# Altium schematic sheet power_block.SchDoc
size A4
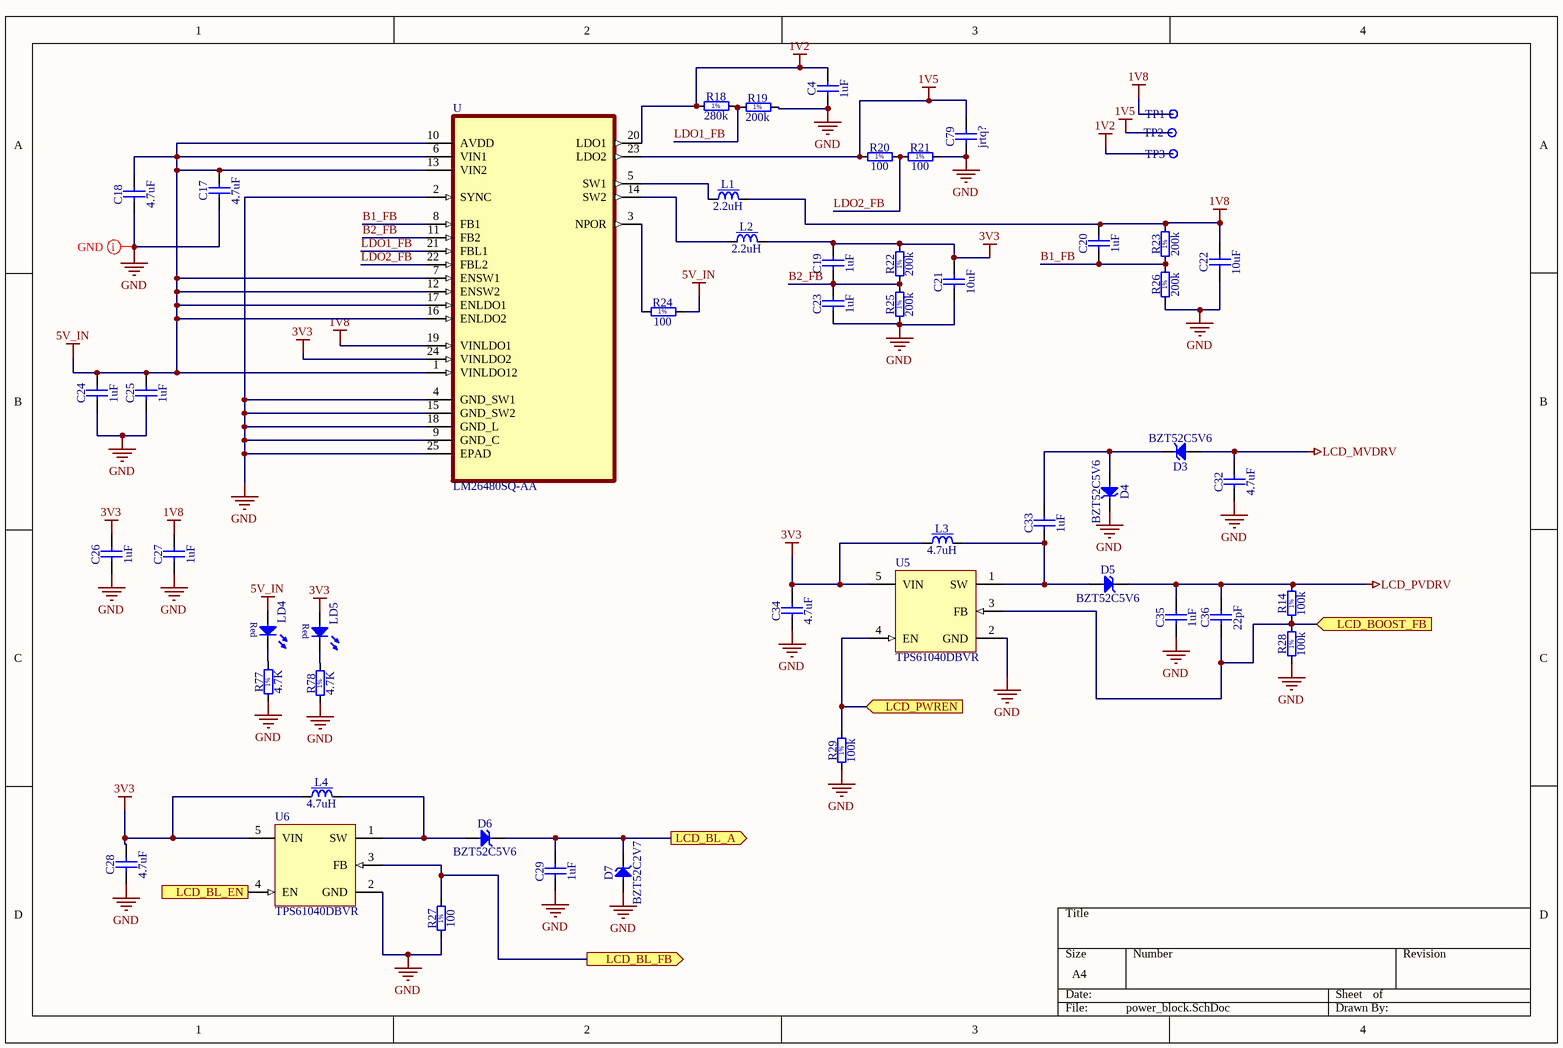
[diagram p0: power_block.SchDoc]

## Parts
C4  1uF  [CAPC2013X100N]
C17  4.7uF  [CAPC2013X100N]
C18  4.7uF  [CAPC2013X100N]
C19  1uF  [CAPC2013X100N]
C20  1uF  [CAPC2013X100N]
C21  10uF  [CAPC2013X100N]
C22  10uF  [CAPC2013X100N]
C23  1uF  [CAPC2013X100N]
C24  1uF  [CAPC2013X100N]
C25  1uF  [CAPC2013X100N]
C26  1uF  [CAPC2013X100N]
C27  1uF  [CAPC2013X100N]
C28  4.7uF  [CAPC2013X100N]
C29  1uF  [CAPC2013X100N]
C32  4.7uF  [CAPC2013X100N]
C33  1uF  [CAPC2013X100N]
C34  4.7uF  [CAPC2013X100N]
C35  1uF  [CAPC2013X100N]
C36  22pF  [CAPC2013X100N]
C79  jrtq?  [CAPC2013X100N]
D3  BZT52C5V6  [SOD3715X145N]
D4  BZT52C5V6  [SOD3715X145N]
D5  BZT52C5V6  [SOD3715X145N]
D6  BZT52C5V6  [SOD3715X145N]
D7  BZT52C2V7  [SOD3715X145N]
L1  2.2uH  [IND_MURATA-PS_8200]
L2  2.2uH  [IND_MURATA-PS_8200]
L3  4.7uH  [IND_MURATA-PS_8200]
L4  4.7uH  [IND_MURATA-PS_8200]
LD4  Super Red  [LED_OSRAM_LSR976]  (value not drawn)
LD5  Super Red  [LED_OSRAM_LSR976]  (value not drawn)
R14  100k  [RESC1608X55N]
R18  280k  [RESC1608X55N]
R19  200k  [RESC1608X55N]
R20  100  [RESC1608X55N]
R21  100  [RESC1608X55N]
R22  200k  [RESC1608X55N]
R23  200k  [RESC1608X55N]
R24  100  [RESC1608X55N]
R25  200k  [RESC1608X55N]
R26  200k  [RESC1608X55N]
R27  100  [RESC1608X55N]
R28  100k  [RESC1608X55N]
R29  100k  [RESC1608X55N]
R77  4.7K  [RESC1608X55N]
R78  4.7K  [RESC1608X55N]
TP1  Test Point  [TPS127]  (value not drawn)
TP2  Test Point  [TPS127]  (value not drawn)
TP3  Test Point  [TPS127]  (value not drawn)
U  LM26480SQ-AA  [QFN400X400X80-25N]
U5  TPS61040DBVR  [TI-DBV5_L]
U6  TPS61040DBVR  [TI-DBV5_L]

## Ports
LCD_BL_A (out), LCD_BL_EN (in), LCD_BL_FB (out), LCD_BOOST_FB (in), LCD_PWREN (in)

## Nets
1V2: C4.2 R18.1 TP3.1 U.20(LDO1)
1V5: C79.2 R20.1 TP2.1 U.23(LDO2)
1V8: C20.2 C22.2 C27.2 L1.2 R23.2 TP1.1 U.19(VINLDO1)
3V3: C19.2 C21.2 C26.2 C28.2 C34.2 L2.2 L3.1 L4.1 LD5.2(A) R22.2 U.24(VINLDO2) U5.5(VIN) U6.5(VIN)
5V_IN: C17.2 C18.2 C24.2 C25.2 LD4.2(A) R24.2 U.1(VINLDO12) U.6(VIN1) U.7(ENSW1) U.10(AVDD) U.12(ENSW2) U.13(VIN2) U.16(ENLDO2) U.17(ENLDO1)
GND: C4.1 C17.1 C18.1 C21.1 C22.1 C23.1 C24.1 C25.1 C26.1 C27.1 C28.1 C29.1 C32.1 C34.1 C35.1 C79.1 D4.1(C) D7.2(A) R19.2 R21.2 R25.1 R26.1 R27.1 R28.1 R29.1 R77.1 R78.1 U.2(SYNC) U.4(GND_SW1) U.9(GND_C) U.15(GND_SW2) U.18(GND_L) U.25(EPAD) U5.2(GND) U6.2(GND)
LCD_MVDRV: C32.2 D3.2(A)
LCD_PVDRV: C35.2 C36.2 D5.1(C) R14.2
B1_FB: C20.1 R23.1 R26.2 U.8(FB1)
B2_FB: C19.1 C23.2 R22.1 R25.2 U.11(FB2)
LCD_BL_A: C29.2 D6.1(C) D7.1(C) ; port LCD_BL_A
LCD_BL_EN: U6.4(EN) ; port LCD_BL_EN
LCD_BL_FB: R27.2 U6.3(FB) ; port LCD_BL_FB
LCD_BOOST_FB: C36.1 R14.1 R28.2 U5.3(FB) ; port LCD_BOOST_FB
LCD_PWREN: R29.2 U5.4(EN) ; port LCD_PWREN
LDO1_FB: R18.2 R19.1 U.21(FBL1)
LDO2_FB: R20.2 R21.1 U.22(FBL2)
NetC33_1: C33.1 D5.2(A) L3.2 U5.1(SW)
NetC33_2: C33.2 D3.1(C) D4.2(A)
NetD6_2: D6.2(A) L4.2 U6.1(SW)
NetL1_1: L1.1 U.5(SW1)
NetL2_1: L2.1 U.14(SW2)
NetLD4_1: LD4.1(C) R77.2
NetLD5_1: LD5.1(C) R78.2
NetR24_1: R24.1 U.3(NPOR)

## Layout directives
rule Clearance Constraint [Clearance = 0.1mm]: GND

## Notes on the sheet
- (in symbol LED_OSRAM_LSR976) Red
- (in symbol R0603_100K_1%_0.1W_100PPM) 1%

## Library data of the parts
C4 C17-C29 C32-C36 C79 = CC0805_1.5NF_50V_5%_C0G: Non-polarised capacitor; Part Description: SMD Multilayer Chip Ceramic Capacitor; Manufacturer: GENERIC; Manufacturer1 Part Number: C0805C152J5GACTU; Value: 1.5nF; Voltage: 50V; TC: C0G/NP0; Tolerance: ±5%; Part Number: CC0805_1.5NF_50V_5%_C0G; Component Kind: Standard; Component Type: Standard; Pin Count: 2; Status: Preferred; Manufacturer Part Number: CC0805_1.5NF_50V_5%_C0G; Case: 0805; Mounted: Yes; Socket: No; SMD: Yes; Sense: No; Manufacturer1 Example: KEMET; Manufacturer1 ComponentHeight: 1mm; HelpURL: \\cern.ch\dfs\Applications\Altium\Datasheets\CC0805_C0G_KEMET_(Commercial Grade).pdf; Author: CERN DEM BC; CreateDate: 18.11.2015; LatestRevisionDate: 18.11.2015
D3-D6 = BZT52C5V6: Zener Diode; Part Description: Surface Mount Zener Diode; Manufacturer: DIODES INCORPORATED; Voltage: 5V6; Power: 0.5W; PressFit: No; Bonding: No; Part Number: BZT52C5V6; Component Kind: Standard; Component Type: Standard; Device: BZT52C5V6; PackageDescription: SOD Diode (SOD123); 2.70mm W X 1.55mm L X 1.45mm H body, IPC Medium Density; Manufacturer Part Number: BZT52C5V6; Pin Count: 2; Case: SOD123; Mounted: Yes; Socket: No; SMD: Yes; Sense: No; ComponentHeight: 1.45mm; HelpURL: \\cern.ch\dfs\Applications\Altium\Datasheets\BZT52C5V6.pdf; Author: CERN DEM JLC; CreateDate: 02.03.2015; LatestRevisionDate: 02.03.2015
D7 = BZT52C2V7: Zener Diode; Part Description: Surface Mount Zener Diode; Manufacturer: DIODES INCORPORATED; Voltage: 2V7; Power: 500mW; PressFit: No; Bonding: No; Part Number: BZT52C2V7; Component Kind: Standard; Component Type: Standard; Device: BZT52C2V7; PackageDescription: SOD Diode (SOD123); 2.70mm W X 1.55mm L X 1.45mm H body, IPC Medium Density; Manufacturer Part Number: BZT52C2V7; Pin Count: 2; Case: SOD123; Mounted: Yes; Socket: No; SMD: Yes; Sense: No; ComponentHeight: 1.45mm; HelpURL: \\cern.ch\dfs\Applications\Altium\Datasheets\BZT52C2V7.pdf; Author: CERN DEM JLC; CreateDate: 02.03.2015; LatestRevisionDate: 02.03.2015
L1-L4 = IND_22UH_10%_MURATA-PS_8200: Inductor With Core; Part Description: Miniature Surface Mount Power Inductor (8200 Series); Manufacturer: MURATA POWER SOLUTIONS; Manufacturer Part Number: 82223C; Value: 22uH; Power: 320mA; Resistance: 0.92R; Tolerance: ±10%; Part Number: IND_22UH_10%_MURATA-PS_8200; Component Kind: Standard; Component Type: Standard; Pin Count: 2; Status: None; Mounted: Yes; Socket: No; SMD: Yes; Sense: No; ComponentHeight: 2.3mm; HelpURL: \\cern.ch\dfs\Applications\Altium\Datasheets\IND_MURATA-PS_8200.pdf; Author: CERN DEM JMW; CreateDate: 07.10.2015; LatestRevisionDate: 07.10.2015
LD4 LD5 = LED_OSRAM_LSR976: LED Red 1C 2A; Part Description: Surface Mount Super Red LED (0805 Case); Manufacturer: OSRAM; Manufacturer Part Number: LSR976; PressFit: No; Bonding: No; Part Number: LED_OSRAM_LSR976; Component Kind: Standard; Component Type: Standard; Color: Super Red; PackageDescription: Super Red Chip LED, 2-Leads, Body 2 x1.25mm, IPC Medium Density; Pin Count: 2; Case: 0805; Mounted: Yes; Socket: No; SMD: Yes; Sense: No; ComponentHeight: 0.9mm; HelpURL: \\cern.ch\dfs\Applications\Altium\Datasheets\LED_OSRAM_LSR976.pdf; Author: CERN DEM JLC; CreateDate: 18.05.2010; LatestRevisionDate: 18.05.2010
R14 R28 R29 = R0603_100K_1%_0.1W_100PPM: Resistor - 1%; Part Description: General Purpose Thick Film Chip Resistor; Manufacturer: GENERIC; Manufacturer1 Part Number: NRC06F1003TRF; Power: 0.1W; TC: ±100ppm/°C; PressFit: No; Part Number: R0603_100K_1%_0.1W_100PPM; Component Kind: Standard; Component Type: Standard; Pin Count: 2; Value: 100k; Status: Preferred; Tolerance: ±1%; Manufacturer Part Number: R0603_100K_1%_0.1W_100PPM; Case: 0603; Mounted: Yes; Sense: No; Socket: No; SMD: Yes; Manufacturer1 Example: NIC COMPONENT; Manufacturer1 ComponentHeight: 0.55mm; HelpURL: \\cern.ch\dfs\Applications\Altium\Datasheets\R0603_NIC_NRC.pdf; Author: CERN DEM JLC; CreateDate: 03.12.2007; LatestRevisionDate: 13.03.2008
R18-R27 R77 R78 = R0603_100K_1%_0.1W_100PPM: Resistor - 1%; Part Description: General Purpose Thick Film Chip Resistor; Manufacturer: GENERIC; Manufacturer1 Part Number: NRC06F1003TRF; Value: 100k; Power: 0.1W; TC: ±100ppm/°C; PressFit: No; Part Number: R0603_100K_1%_0.1W_100PPM; Component Kind: Standard; Component Type: Standard; Pin Count: 2; Status: Preferred; Tolerance: ±1%; Manufacturer Part Number: R0603_100K_1%_0.1W_100PPM; Case: 0603; Mounted: Yes; Sense: No; Socket: No; SMD: Yes; Manufacturer1 Example: NIC COMPONENT; Manufacturer1 ComponentHeight: 0.55mm; HelpURL: \\cern.ch\dfs\Applications\Altium\Datasheets\R0603_NIC_NRC.pdf; Author: CERN DEM JLC; CreateDate: 03.12.2007; LatestRevisionDate: 13.03.2008
TP1-TP3 = SMD_PAD_1.27X1.27MM: Part Description: 1.27mm x 1.27mm PCB Copper Area (SMD Test Point); Mounted: No; Part Number: SMD_PAD_1.27X1.27MM; Component Kind: Standard (No BOM); Component Type: Standard (No BOM); Pin Count: 1; Family: Test Point; Socket: No; SMD: Yes; Sense: No; Status: None; ComponentHeight: 0mm; HelpURL: Undefined; Author: CERN DEM JLC; CreateDate: 12.01.2008; LatestRevisionDate: 12.01.2008; PackageDescription: 1.27mm x 1.27mm PCB Copper Area (SMD Test Point)
U = LM26480SQ-AA: PMIC - Voltage Regulators - Linear + Switching 4 Output Step-Down _Buck_ Synchronous _2_, Linear _LDO_ _2_ 2MHz 24-WQFN _4x4_; MF: Texas Instruments; Package: WQFN-24 Texas Instruments; MP: LM26480SQ-AA; Value: *; Availability: Unavailable; Price: None; SnapEDA_Link: https://www.snapeda.com/parts/LM26480SQ-AA/Texas%20Instruments/view-part/28484/?ref=snap
U5 U6 = TPS61040DBVR: 28 V, 400 mA Switch Boost Converter for White LED Applications, 1.8 to 6 V, -40 to 85 degC, 5-pin SOT23 (DBV5), Green (RoHS & no Sb/Br); Manufacturer: Texas Instruments; Dimming: TRUE; Iout(Max)(A): 0.09; Iq(Typ)(mA): 0.028; Rating: Catalog; SubFamily: White LED Driver; Switching Frequency(Max)(kHz): 1000; Vin(Max)(V): 6; Vin(Min)(V): 1.8; DatasheetVersion: SLVS413F; PackageVersion: 4073253-4/K; PackageReference: DBV5; PackageDescription: 5-Pin Plastic Small Outline, Body 1.60 Г— 2.90 mm, Pitch 0.95 mm; Supplier 1: Digi-Key; Supplier Part Number 1: 296-12685-2-ND; Supplier 2: Digi-Key; Supplier Part Number 2: 296-12685-1-ND; Supplier 3: Digi-Key; Supplier Part Number 3: 296-12685-6-ND; Supplier 4: Farnell; Supplier Part Number 4: 1461061; Supplier 5: Farnell; Supplier Part Number 5: 1461061RL; Supplier 6: Newark; Supplier Part Number 6: 35K1326; Supplier 7: Mouser; Supplier Part Number 7: 595-TPS61040DBVR; Eco-Plan: Green (RoHS & no Sb/Br); Topology: Boost; Mounting Technology: Surface Mount; Code_JEDEC: MO-178; PartNumber: TPS61040DBVR; ComponentLink1Description: Manufacturer URL; ComponentLink1URL: http://www.ti.com/; ComponentLink2Description: Datasheet; ComponentLink2URL: http://www.ti.com/general/docs/lit/getliterature.tsp?genericPartNumber=TPS61040&fileType=pdf; ComponentLink3Description: Package Specification; ComponentLink3URL: http://www.ti.com/litv/pdf/mpds018i